# EAGLE schematic amplifier (EAGLE 8.6.0)
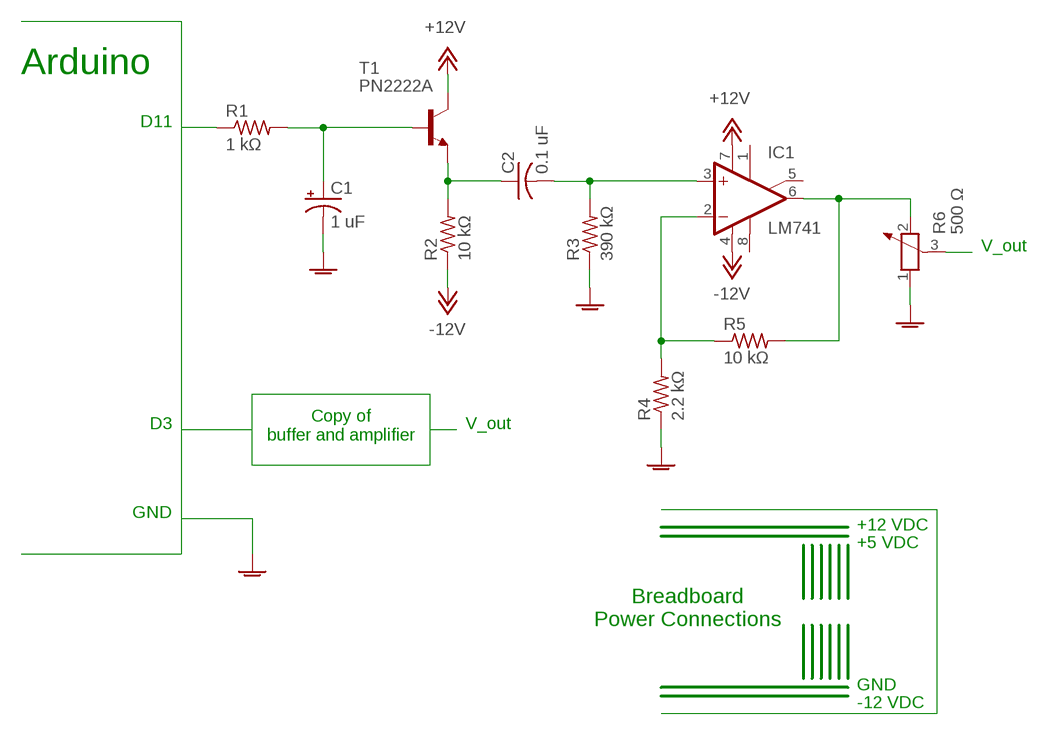
[diagram p0: schematic, sheet 1]

## Parts
C1  1 uF  CPOL-US085CS-1AR  [085CS_1AR]
C2  0.1 uF  C-US025-050X050  [C025-050X050]
IC1  LM741  LM741D  [SO08]
R1  1 kΩ  R-US_0204/2V  [0204V]
R2  10 kΩ  R-US_0204/2V  [0204V]
R3  390 kΩ  R-US_0204/2V  [0204V]
R4  2.2 kΩ  R-US_0204/2V  [0204V]
R5  10 kΩ  R-US_0204/2V  [0204V]
R6  500 Ω  POTENTIOMETER_PT-10  [PT-10]
T1  PN2222A  2N2222-NPN-TO92-EBC  [TO92-EBC]

## Nets
+12V: IC1.7(V+) T1.C
-12V: IC1.4(V-) R2.1
AGND: C1.- R1.1 R3.1 R4.1 R6.1
N$2: C1.+ R1.2 T1.B
N$3: C2.1 R2.2 T1.E
N$4: C2.2 IC1.3(+IN) R3.2
N$5: IC1.6(OUT) R5.2 R6.2
N$6: IC1.2(-IN) R4.2 R5.1
Unconnected: IC1.1(ON1) IC1.5(ON2) IC1.8(OPT) R6.3

## Notes on the sheet
- Arduino
- D11
- V_out
- Copy of
  buffer and amplifier
- D3 | V_out
- GND | +12 VDC
- +5 VDC
- Breadboard
  Power Connections
- GND
- -12 VDC

## Library data of the parts
C1 = rcl:CPOL-US: POLARIZED CAPACITOR, American symbol; SPICEPREFIX: C
C2 = rcl:C-US: CAPACITOR, American symbol; SPICEPREFIX: C
IC1 = linear:*741: OP AMP
R1-R5 = rcl:R-US_: RESISTOR, American symbol; SPICEPREFIX: R
R6 = rcl:POTENTIOMETER_: Potentiometer; SPICEMODEL: POT; SPICEPREFIX: X
T1 = transistor-neu-to92:*-NPN-: NPN Transistror